# Altium schematic sheet LED_board_schematic_pg_2.SchDoc
size A4; SheetNumber: 2; SheetTotal: 2
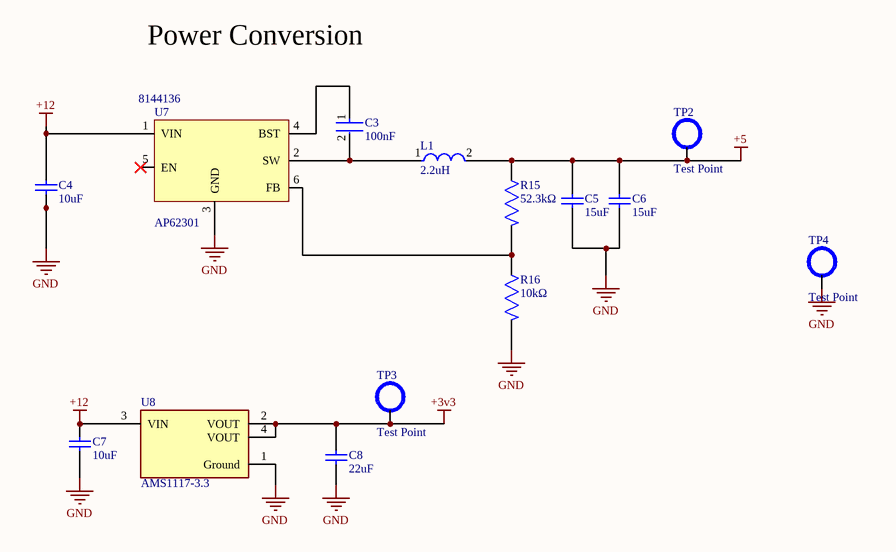
[diagram p0: LED_board_schematic_pg_2.SchDoc]

## Parts
C3  100nF  [FP-C0402-BB-MFG]
C4  10uF  [0805 PACKAGE]
C5  15uF  [0603 PACKAGE]
C6  15uF  [0603 PACKAGE]
C7  10uF  [0805 PACKAGE]
C8  22uF  [0603 PACKAGE]
L1  2.2uH  [FP-IHLP-1212BZ-11-MFG]
R15  52.3kΩ  [0402 PACKAGE]
R16  10kΩ  [0402 PACKAGE]
TP2  Test Point  [Test Point]
TP3  Test Point  [Test Point]
TP4  Test Point  [Test Point]
U7  AP62301  Supplier Part Number 1: 8144136  [AP62301]
U8  AMS1117-3.3  [FP-AMS1117-IPC_C]

## Nets
+3v3: C8.2 TP3.1 U8.2(VOUT) U8.4(VOUT)
+5: C5.2 C6.2 L1.2 R15.1 TP2.1
+12: C4.2 C7.2 U7.1(VIN) U8.3(VIN)
GND: C4.1 C5.1 C6.1 C7.1 C8.1 R16.2 TP4.1 U7.3(GND) U8.1(Ground)
NetC3_1: C3.1 U7.4(BST)
NetC3_2: C3.2 L1.1 U7.2(SW)
NetR15_2: R15.2 R16.1 U7.6(FB)

Not connected (* = marked no-connect by the designer): U7 5(EN)*

## Notes on the sheet
- Power Conversion

## Library data of the parts
C3 = CMP-2008-02046-2: CAP CER 0.1UF 10V X5R 0402; Manufacturer: Kemet; Manufacturer Part Number: C0402C104K8PACTU; Material: Ceramic; Capacitance: 0.10 μF; Temperature Coefficient: 15%; Tolerance: 0.1; Value: 0.10 μF; Package: C0402-BB; Temperature: -55°C to +125°C; ComponentLink2Description: Datasheet; Temperature Characteristic: X5R; Device Class L1: Passive Components; Height: 0.55mm; Lead Free: Yes; ComponentLink2URL: https://content.kemet.com/datasheets/KEM_C1002_X7R_SMD.pdf; Device Class L2: Capacitors; Temperature Range Low: -55°C; Temperature Range High: +125°C; RoHS: TRUE; Octopart: https://octopart.com/c0402c104k8pactu-kemet-140039; Automotive: No; Mouser Description: Capacitor 100 nF 10 VDC 0402; Category: Cap; Voltage Rating: 10 V; Digikey Description: CAP CER 0.1UF 10V X5R 0402; Ipc Land Pattern Name: CAPC10050X50; Device Class L3: Ceramic Capacitors
C4 C7 = Capacitor: Chip Multilayer Ceramic Capacitors for General Purpose, 0805, 10uF, X5R, 15%, 10%, 16V
C5 C6 = Capacitor: Chip Multilayer Ceramic Capacitors for General Purpose, 0603, 15uF, X5R, 15%, 20%, 10V
C8 = Capacitor: Chip Multilayer Ceramic Capacitors for General Purpose, 0603, 22uF, X5R, 15%, 20%, 10V
L1 = CMP-02424-000689-1: FIXED IND 2.2UH 3A 46 MOHM SMD; DC Resistance (DCR): 46mR; Inductance Tolerance: 20%; Saturation Current: 3.3A; Self Resonant Frequency: 55MHz; Core Material: Metal; Shielding: Shielded; Test Frequency: 100kHz; RMS Current (Irms): 3A; Max DC Current: 3A; Contact Plating: Tin; Mount: Surface Mount; Series: IHLP-1212BZ-11; Inductance: 2.2uH; Current Rating: 3A; Height - Seated (Max): 0.079inch; Radiation Hardening: No; Package Quantity: 3000; Max Operating Temperature: 125°C; Military Standard: Not; Depth: 3.2mm; Rated Current-Max: 3A; Height: 2mm; Lead Free: Lead Free; Termination: SMD/SMT; RoHS Compliant: Yes; Tolerance: 20%; Packaging: Tape and Reel; Case/Package: 1212; Number of Pins: 2; Min Operating Temperature: -55°C; Width: 3mm; Length: 3.6mm
R15 R16 = Resistor: RES 10K OHM 1% 1/16W 0402
  R15: Supplier 1: Mouser
  R16: Supplier 1: Future Electronics
U7 = AP62301: Buck Converter / SOT-563; Supplier 1: Future Electronics
U8 = CMP-209535-000001-1: LDO Voltage Regulators 1A, 3.3V; Manufacturer: Advanced Monolithic Systems; Dropout Voltage: 1.1V; Output Type: Fixed; Nominal Supply Current: 5mA; Max Power Dissipation: 1.2W; Max Supply Voltage: 15V; Number Of Outputs: 1; Standoff Height: 0.64mm; Max Junction Temp: +125°C; Height: 1.8mm; Package: AMS1117; Device Class L2: Power Management ICs; ComponentLink2Description: Datasheet; ComponentLink2URL: http://www.advanced-monolithic.com/pdf/ds1117.pdf; Category: IC; RoHS: TRUE; Automotive: No; Device Class L1: Integrated Circuits (ICs); Output Current: 1A; Device Class L3: Voltage Regulators - Linear; Temperature: -40°C to +125°C; Output Voltage: 3.3V; Manufacturer Part Number: AMS1117-3.3; Temperature Range Low: -40°C; Octopart: https://octopart.com/ams1117-3.3-advanced+monolithic+systems-25899300; Lead Free: Yes; Ipc Land Pattern Name: SOT229P700X180-4; Temperature Range High: +125°C